# Altium project DCAV32_WINGLET_V1P_OSR.PrjPcb (part 2 of 3)

## Sheet SCH_WINGLET_DISP.SchDoc: Winglet LCD Display
size B; DrawnBy: HCAdam; Organization: Aerospace Village; DocumentNumber: WINGLET; Revision: A; SheetNumber: 5; SheetTotal: 10
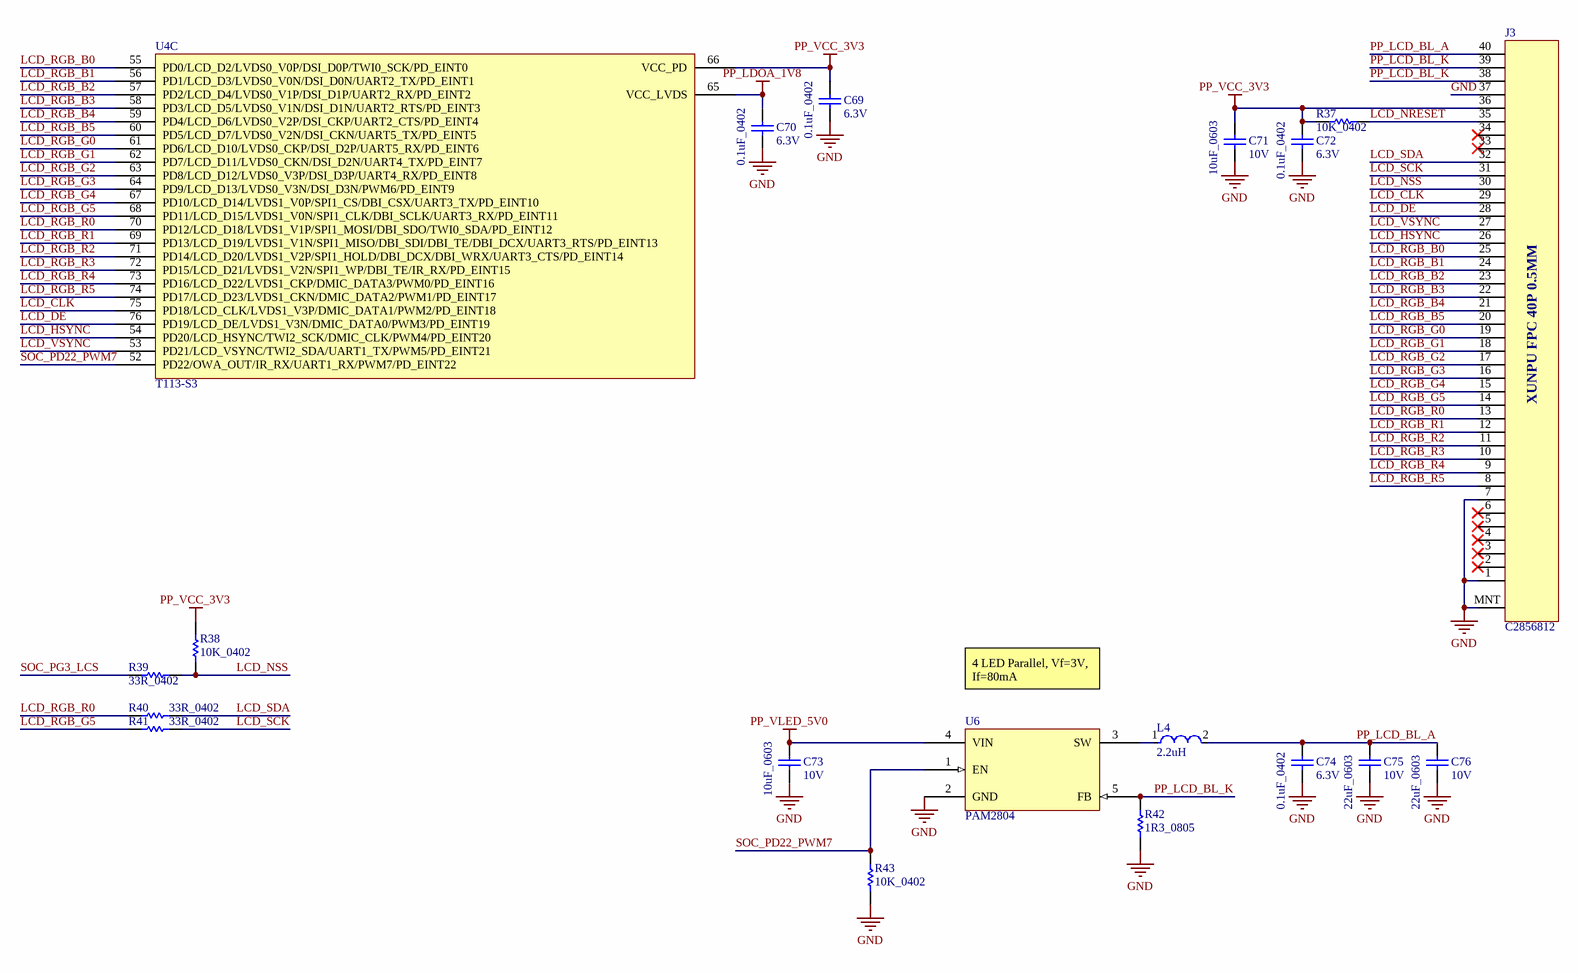
[diagram p4: SCH_WINGLET_DISP.SchDoc]

### Parts
C69  0.1uF_0402  Voltage Rating: 6.3V  [CAPC1005X56X25NL10T15]
C70  0.1uF_0402  Voltage Rating: 6.3V  [CAPC1005X56X25NL10T15]
C71  10uF_0603  Voltage Rating: 10V  [CAPC1609X100X15NL20]
C72  0.1uF_0402  Voltage Rating: 6.3V  [CAPC1005X56X25NL10T15]
C73  10uF_0603  Voltage Rating: 10V  [CAPC1609X100X15NL20]
C74  0.1uF_0402  Voltage Rating: 6.3V  [CAPC1005X56X25NL10T15]
C75  22uF_0603  Voltage Rating: 10V  [CAPC1608X100X20NL10]
C76  22uF_0603  Voltage Rating: 10V  [CAPC1608X100X20NL10]
J3  C2856812  [LCSC_FPC_40P_0P5MM]
L4  2.2uH  [FP-NR3015-MFG]
R37  10K_0402  [RESC1005X40X25NL05T05]
R38  10K_0402  [RESC1005X40X25NL05T05]
R39  33R_0402  [RESC1005X40X25NL05T05]
R40  33R_0402  [RESC1005X40X25NL05T05]
R41  33R_0402  [RESC1005X40X25NL05T05]
R42  1R3_0805  [RESC2013X50X30NL20T20]
R43  10K_0402  [RESC1005X40X25NL05T05]
U4  T113-S3  [TSQFP40P1600X1600X160_HS-129N]  (part C of 7)
U6  PAM2804  [SOT95P292X115-5N]

### Nets
GND: C69.1 C70.1 C71.1 C72.1 C73.1 C74.1 C75.1 C76.1 J3.1 J3.7 J3.37 J3.MNT R42.1 R43.2 U6.2(GND)
PP_LDOA_1V8: C70.2 U4.65(VCC_LVDS)
PP_VCC_3V3: C69.2 C71.2 C72.2 J3.36 R37.1 R38.1 U4.66(VCC_PD)
PP_VLED_5V0: C73.2 U6.4(VIN)
LCD_CLK: J3.29 U4.75(PD18/LCD_CLK/LVDS1_V3P/DMIC_DATA1/PWM2/PD_EINT18)
LCD_DE: J3.28 U4.76(PD19/LCD_DE/LVDS1_V3N/DMIC_DATA0/PWM3/PD_EINT19)
LCD_HSYNC: J3.26 U4.54(PD20/LCD_HSYNC/TWI2_SCK/DMIC_CLK/PWM4/PD_EINT20)
LCD_NRESET: J3.35 R37.2
LCD_NSS: J3.30 R38.2 R39.2
LCD_RGB_B0: J3.25 U4.55(PD0/LCD_D2/LVDS0_V0P/DSI_D0P/TWI0_SCK/PD_EINT0)
LCD_RGB_B1: J3.24 U4.56(PD1/LCD_D3/LVDS0_V0N/DSI_D0N/UART2_TX/PD_EINT1)
LCD_RGB_B2: J3.23 U4.57(PD2/LCD_D4/LVDS0_V1P/DSI_D1P/UART2_RX/PD_EINT2)
LCD_RGB_B3: J3.22 U4.58(PD3/LCD_D5/LVDS0_V1N/DSI_D1N/UART2_RTS/PD_EINT3)
LCD_RGB_B4: J3.21 U4.59(PD4/LCD_D6/LVDS0_V2P/DSI_CKP/UART2_CTS/PD_EINT4)
LCD_RGB_B5: J3.20 U4.60(PD5/LCD_D7/LVDS0_V2N/DSI_CKN/UART5_TX/PD_EINT5)
LCD_RGB_G0: J3.19 U4.61(PD6/LCD_D10/LVDS0_CKP/DSI_D2P/UART5_RX/PD_EINT6)
LCD_RGB_G1: J3.18 U4.62(PD7/LCD_D11/LVDS0_CKN/DSI_D2N/UART4_TX/PD_EINT7)
LCD_RGB_G2: J3.17 U4.63(PD8/LCD_D12/LVDS0_V3P/DSI_D3P/UART4_RX/PD_EINT8)
LCD_RGB_G3: J3.16 U4.64(PD9/LCD_D13/LVDS0_V3N/DSI_D3N/PWM6/PD_EINT9)
LCD_RGB_G4: J3.15 U4.67(PD10/LCD_D14/LVDS1_V0P/SPI1_CS/DBI_CSX/UART3_TX/PD_EINT10)
LCD_RGB_G5: J3.14 R41.1 U4.68(PD11/LCD_D15/LVDS1_V0N/SPI1_CLK/DBI_SCLK/UART3_RX/PD_EINT11)
LCD_RGB_R0: J3.13 R40.1 U4.70(PD12/LCD_D18/LVDS1_V1P/SPI1_MOSI/DBI_SDO/TWI0_SDA/PD_EINT12)
LCD_RGB_R1: J3.12 U4.69(PD13/LCD_D19/LVDS1_V1N/SPI1_MISO/DBI_SDI/DBI_TE/DBI_DCX/UART3_RTS/PD_EINT13)
LCD_RGB_R2: J3.11 U4.71(PD14/LCD_D20/LVDS1_V2P/SPI1_HOLD/DBI_DCX/DBI_WRX/UART3_CTS/PD_EINT14)
LCD_RGB_R3: J3.10 U4.72(PD15/LCD_D21/LVDS1_V2N/SPI1_WP/DBI_TE/IR_RX/PD_EINT15)
LCD_RGB_R4: J3.9 U4.73(PD16/LCD_D22/LVDS1_CKP/DMIC_DATA3/PWM0/PD_EINT16)
LCD_RGB_R5: J3.8 U4.74(PD17/LCD_D23/LVDS1_CKN/DMIC_DATA2/PWM1/PD_EINT17)
LCD_SCK: J3.31 R41.2
LCD_SDA: J3.32 R40.2
LCD_VSYNC: J3.27 U4.53(PD21/LCD_VSYNC/TWI2_SDA/UART1_TX/PWM5/PD_EINT21)
PP_LCD_BL_A: C74.2 C75.2 C76.2 J3.40 L4.2
PP_LCD_BL_K: J3.38 J3.39 R42.2 U6.5(FB)
SOC_PD22_PWM7: R43.1 U4.52(PD22/OWA_OUT/IR_RX/UART1_RX/PWM7/PD_EINT22) U6.1(EN)
SOC_PG3_LCS: R39.1
NetL4_1: L4.1 U6.3(SW)

Not connected (* = marked no-connect by the designer): J3 2* 3* 4* 5* 6* 33* 34*

### Notes on the sheet
- 4 LED Parallel, Vf=3V, If=80mA
- Title
- Size:
- Date:
- B
- Project:
- Revision:
- Sheet
- of
- Drawn By:
- (in symbol FPC-05F-40PH20) XUNPU FPC 40P 0.5MM

### Library data of the parts
C69 C70 C72 C74 = CMP-2008-02743-1: as C7 on sheet SCH_WINGLET_BMU; Part Number: 04026D104KAT2A
C71 C73 = CMP-2006-00191-1: Part Number: TACL106M006XTA; Manufacturer: AVX Interconnect / Elco
C75 C76 = CMP-2000-05441-1: Chip Capacitor, 22 uF, +/- 20%, 10 V, -55 to 85 degC, 0603 (1608 Metric), RoHS, Tape and Reel / PN: C1608X5R1A226M080AC; Manufacturer: TDK; PCN Part Number: MLCCPartNumberChange30/Nov/2012; Product Training Modules: CSeriesGeneralApplicationsSEAT,CCV,andTVCLDesignToolsGuidetoReplacinganElectrolyticCapacitorwithanMLCC; Other Names: 445-9077-1; Design Resources: 20WNon-IsolatedBuckLEDDriverUsingPLLNK460KG; Online Catalog: CSeries,GeneralPurpose; Capacitance: 22µF; Temperature Coefficient: X5R; Kits: 445-9014-KIT-ND-KITMLCC100PF-22UF060310-50V; Packaging: CutTape(CT); Standard Package: 1; Package / Case: 0603(1608Metric); Lead Style: -; Features: -; Ratings: -; Voltage - Rated: 10V; Operating Temperature: -55degC~85degC; Applications: GeneralPurpose; Package Reference: 603; Datasheet URL: http://download.siliconexpert.com/pdfs/2015/4/21/15/54/45/779/tdk_/manual/37024850441143360mlcc_commercial_general_en.pdf; Datasheet Version: Mar-15; Mounting Type: SurfaceMount,MLCC; Lead Spacing: -; Size / Dimension: 0.063"Lx0.031"W(1.60mmx0.80mm); Height - Seated (Max): -; Package Description: 2-Pin Surface Mount Device, Body 1.6 x 0.8 mm; Manufacturer URL: http://www.tdk.com/; RoHS Information: RoHSCertificate-MLCC; Tolerance: ±20%; Series: C; Thickness (Max): 0.035"(0.90mm); Family: CeramicCapacitors; Category: Capacitors
J3 = FPC-05F-40PH20: XUNPU FPC 40P 0.5MM / C2856812
L4 = CMP-0569-00001-3: SMD Power Inductors 2.2uH ±20% 1.48A 72mΩ / NR3015T2R2M; RMS Current (Irms): 1.5A; Shielding: Shielded; Self Resonant Frequency: 64MHz; Test Frequency: 100kHz; DC Resistance (DCR): 72mR; Core Material: Ferrite; Package Quantity: 1; Current Rating: 1.48A; Height - Seated (Max): 0.059inch; Width: 0.118inch; Inductance Tolerance: 20%; Tolerance: 20%; Resistor Type: Wirewound; RoHS Compliant: Yes; Case/Package: 3015; Length: 0.118inch; Max DC Current: 1.5A; Max Operating Temperature: 120°C; Inductance: 2.2uH; Saturation Current: 1.48A; Min Operating Temperature: -25°C; Height: 1.5mm; Series: NR; Lead Free: Lead Free; Packaging: Tape and Reel; Halogen Free: Halogen Free; Termination: SMD/SMT; Number of Pins: 2
R37 R38 R43 = CMP-2000-07588-1: Chip Resistor, 10 KOhm, +/- 1%, 0.1 W, -55 to 155 degC, 0402 (1005 Metric), RoHS, Tape and Reel / ERJ2RKF1002X; Manufacturer: Panasonic; Power Rating: 100mW; Voltage Rating: 50V; Resistance: 10KOhm; Case\/Package: 0402; Temperature Coefficient: 100ppm\/degreesC; RoHSCompliant: True; Lead Free: LeadFree; Package Quantity: 1; Contact Plating: Tin; Length: 1mm; Radiation Hardening: No; REACH SVHC: NoSVHC; Max Operating Temperature: 155degC; Depth: 0.5mm; Case Code (Imperial): 0402; Military Standard: Not; Package Description: 2-Pin Surface Mount Device, Body 1 x 0.5 mm; Termination: SMD/SMT; Case Code (Metric): 1005; Height: 0.35mm; Packaging: TapeandReel; Voltage Rating (DC): 50V; Package Reference: 402; Number of Pins: 2; Tolerance: 1%; Mounting Technology: SurfaceMount; Width: 0.02inch; Mount: SurfaceMount; Datasheet URL: https://industrial.panasonic.com/cdbs/www-data/pdf/RDA0000/AOA0000C304.pdf; Composition: ThickFilm; Datasheet Version: 02/2017; Manufacturer URL: http://www.panasonic.com/; Max Power Dissipation: 100mW; Number of Terminations: 2; Min Operating Temperature: -55degC
R39-R41 = CMP-2002-01146-1: ERJ2RKF33R0X; Manufacturer: Panasonic; Part Number: ERJ2RKF33R0X
R42 = CMP-2001-03654-1: CRCW08051R30JNEA; Manufacturer: Vishay Dale; Part Number: CRCW08051R30JNEA
U4 = T113-S3: Allwinner Dual-core ARM Cortex-A7 Smart Control and Display SoC
U6 = PAM2804: 1A 1.5MHz STEP-DOWN CONSTANT CURRENT, HIGH EFFICIENCY LED DRIVER

## Sheet SCH_WINGLET_WIFI.SchDoc: Winglet Wi-Fi
size B; DrawnBy: HCAdam; Organization: Aerospace Village; DocumentNumber: WINGLET; Revision: A; SheetNumber: 6; SheetTotal: 10
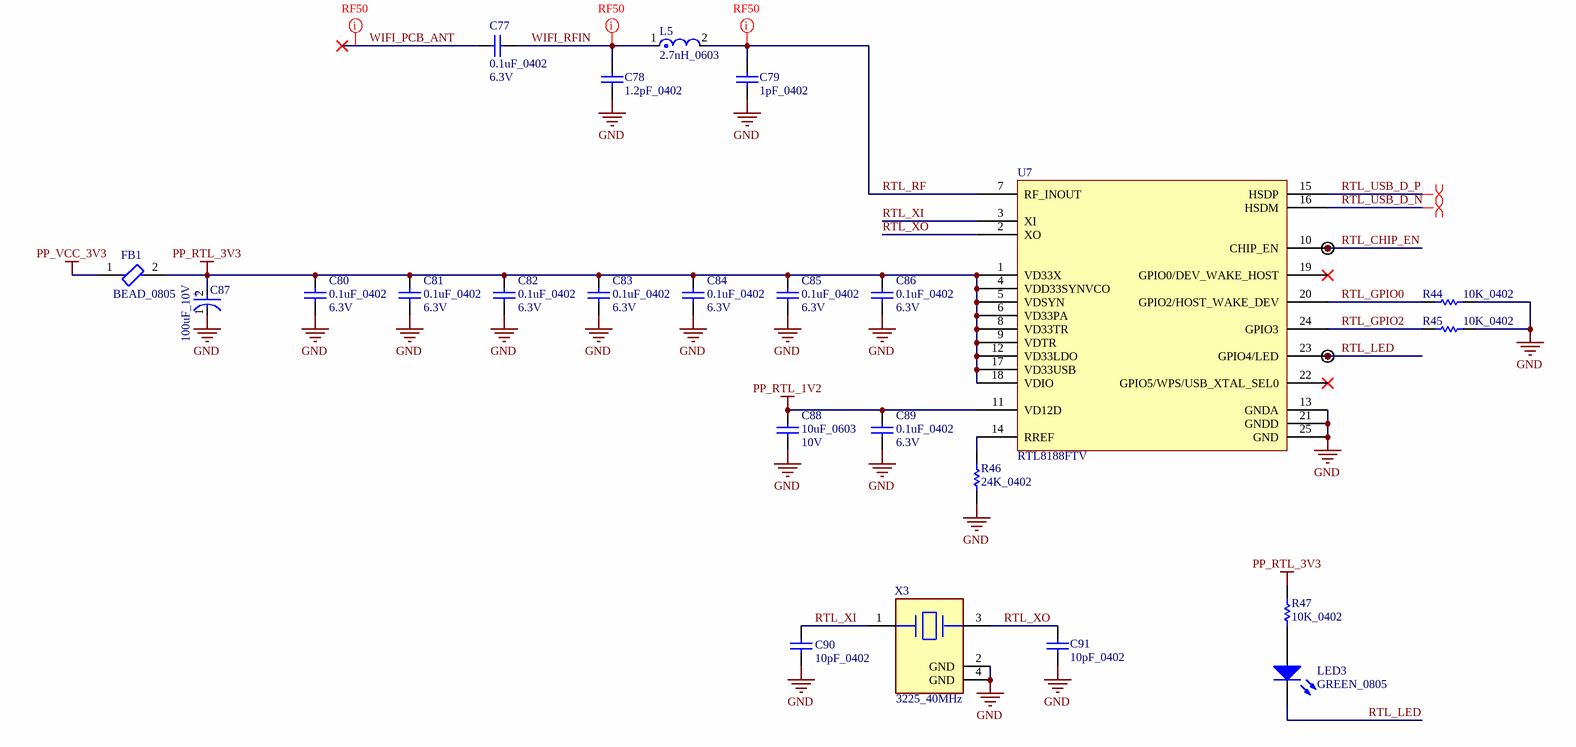
[diagram p5: SCH_WINGLET_WIFI.SchDoc]

### Parts
C77  0.1uF_0402  Voltage Rating: 6.3V  [CAPC1005X56X25NL10T15]
C78  1.2pF_0402  [CAPC1005X61X26NL10T16]
C79  1pF_0402  [CAPC1005X56X25NL10T15]
C80  0.1uF_0402  Voltage Rating: 6.3V  [CAPC1005X56X25NL10T15]
C81  0.1uF_0402  Voltage Rating: 6.3V  [CAPC1005X56X25NL10T15]
C82  0.1uF_0402  Voltage Rating: 6.3V  [CAPC1005X56X25NL10T15]
C83  0.1uF_0402  Voltage Rating: 6.3V  [CAPC1005X56X25NL10T15]
C84  0.1uF_0402  Voltage Rating: 6.3V  [CAPC1005X56X25NL10T15]
C85  0.1uF_0402  Voltage Rating: 6.3V  [CAPC1005X56X25NL10T15]
C86  0.1uF_0402  Voltage Rating: 6.3V  [CAPC1005X56X25NL10T15]
C87  100uF_10V  [FP-TAJB-MFG]
C88  10uF_0603  Voltage Rating: 10V  [CAPC1609X100X15NL20]
C89  0.1uF_0402  Voltage Rating: 6.3V  [CAPC1005X56X25NL10T15]
C90  10pF_0402  [CAPC1006X50X20NL10T10]
C91  10pF_0402  [CAPC1006X50X20NL10T10]
FB1  BEAD_0805  [FP-BLM21-0_2-t0_85-e0_5-IPC_B]
L5  2.7nH_0603  [FP-LQG18HH_00-IPC_B]
LED3  GREEN_0805  [0805_A]
R44  10K_0402  [RESC1005X40X25NL05T05]
R45  10K_0402  [RESC1005X40X25NL05T05]
R46  24K_0402  [RESC1005X40X25NL05T05]
R47  10K_0402  [RESC1005X40X25NL05T05]
TP25  TESTPOINT  [TESTPOINT-0.7MM-SINGLE-LAYER]  (value not drawn)  (no BOM)
TP26  TESTPOINT  [TESTPOINT-0.7MM-SINGLE-LAYER]  (value not drawn)  (no BOM)
U7  RTL8188FTV  [QFN50P400X400X90_HS-25N_RTL]
X3  3225_40MHz  [FP-ABM8-MFG]

### Nets
GND: C78.1 C79.1 C80.1 C81.1 C82.1 C83.1 C84.1 C85.1 C86.1 C87.1(C) C88.1 C89.1 C90.1 C91.1 R44.1 R45.1 R46.1 U7.13(GNDA) U7.21(GNDD) U7.25(GND) X3.2(GND) X3.4(GND)
PP_RTL_1V2: C88.2 C89.2 U7.11(VD12D)
PP_RTL_3V3: C80.2 C81.2 C82.2 C83.2 C84.2 C85.2 C86.2 C87.2(A) FB1.2 R47.1 U7.1(VD33X) U7.4(VDD33SYNVCO) U7.5(VDSYN) U7.6(VD33PA) U7.8(VD33TR) U7.9(VDTR) U7.12(VD33LDO) U7.17(VD33USB) U7.18(VDIO)
PP_VCC_3V3: FB1.1
RTL_CHIP_EN: TP25.1 U7.10(CHIP_EN)
RTL_GPIO0: R44.2 U7.20(GPIO2/HOST_WAKE_DEV)
RTL_GPIO2: R45.2 U7.24(GPIO3)
RTL_LED: LED3.1(K) TP26.1 U7.23(GPIO4/LED)
RTL_RF: C79.2 L5.2 U7.7(RF_INOUT)
RTL_USB_D_N: U7.16(HSDM)
RTL_USB_D_P: U7.15(HSDP)
RTL_XI: C90.2 U7.3(XI) X3.1
RTL_XO: C91.2 U7.2(XO) X3.3
WIFI_PCB_ANT: C77.2
WIFI_RFIN: C77.1 C78.2 L5.1
NetLED3_2: LED3.2(A) R47.2
NetR46_2: R46.2 U7.14(RREF)

Not connected (* = marked no-connect by the designer): U7 19(GPIO0/DEV_WAKE_HOST)* 22(GPIO5/WPS/USB_XTAL_SEL0)*

### Layout directives
differential pair: RTL_USB_D_N, RTL_USB_D_P
net class RF_50Z: RTL_RF, WIFI_PCB_ANT, WIFI_RFIN

### Notes on the sheet
- Title
- Size:
- Date:
- B
- Project:
- Revision:
- Sheet
- of
- Drawn By:
- (in symbol CMP-04424-000366-1) +

### Library data of the parts
C77 C80-C86 C89 = CMP-2008-02743-1: as C7 on sheet SCH_WINGLET_BMU; Part Number: 04026D104KAT2A
C78 = CMP-2008-01995-1: VJ0402D1R0BXCAJ; Manufacturer: Vitramon; Part Number: VJ0402D1R0BXCAJ
C79 = CMP-1034-00084-2: 04025A1R2BAT2A; Manufacturer: AVX Interconnect / Elco; Part Number: 04025A1R2BAT2A
C87 = CMP-04424-000366-1: 100uF 10V ±10% 1.7Ω SMD CASE-B (3528) Tantalum Capacitor; Voltage Rating (DC): 6.3V; ESR (Equivalent Series Resistance): 1.7R; Polarity: Polar; Leakage Current: 6.3uA; Height: 1.9mm; Depth: 2.8mm; Length: 3.5mm; Min Operating Temperature: -55°C; Width: 2.8mm; Series: TAJ; Lead Free: Lead Free; Case/Package: 1210; Voltage: 6.3V; Mount: Surface Mount; Tolerance: 10%; Capacitance: 100uF; Radiation Hardening: No; REACH SVHC: No SVHC; Voltage Rating: 6.3V; Case Code (Metric): 3528; Dissipation Factor: 10%; Packaging: Tape and Reel; Construction: Flat; Features: General Purpose; Max Operating Temperature: 125°C; RoHS Compliant: Yes; Package Quantity: 1; Dielectric Material: Tantalum; Termination: SMD/SMT; Case Code (Imperial): 1210; Height - Seated (Max): 0.083inch
C88 = CMP-2006-00191-1: as C71 on sheet SCH_WINGLET_DISP
C90 C91 = CMP-2008-04829-1: 0402YJ100FBSTR; Manufacturer: AVX Interconnect / Elco; Part Number: 0402YJ100FBSTR
FB1 = CMP-0686-00717-3: Chip Ferrite Bead, 0805, 150Ω @ 100MHz, 0.09Ω, 25%, 1A; Number of Circuits: 1; Max Current Rating: 800mA; DC Resistance (DCR): 100mR; Shielding: Unshielded; DC Current: 200mA; Impedance: 150R; Contact Plating: Tin; Weight: 0.000194oz; Series: EMIFIL®, BLM21A; Core Material: Ferrite; Test Frequency: 100MHz; Case Code (Metric): 2012; Package Quantity: 4000; Lead Free: Lead Free; Max Operating Temperature: 125°C; Case Code (Imperial): 0805; Material: Ferrite; Min Operating Temperature: -55°C; Tolerance: 25%; Length: 2mm; DC Resistance-Max: 100mR; Width: 1.25mm; RoHS Compliant: Yes; Packaging: Tape and Reel; REACH SVHC: No SVHC; Depth: 1.45mm; Number of Pins: 2; Radiation Hardening: No; Current Rating: 800mA; Height: 0.85mm; Termination: SMD/SMT; Number of Lines: 1; Max DC Current: 200mA; Case/Package: 0805
L5 = CMP-06042-013926-1: Multilayer type RF Inductor 2.7nH ±0.3nH 0.12Ω 1000mA 0603 / LQG18HN2N7S00D; Current Rating: 500mA; DC Resistance (DCR): 150mR; Q Factor: 12; Self Resonant Frequency: 6GHz; Test Frequency: 100MHz; Shielding: Unshielded; Core Material: Air; Mount: Surface Mount; Lead Free: Lead Free; Length: 1.75mm; Inductance: 2.7nH; Case Code (Imperial): 0603; Military Standard: Not; Case Code (Metric): 1608; Max DC Current: 500mA; Min Operating Temperature: -55°C; Depth: 0.95mm; REACH SVHC: No SVHC; Termination: SMD/SMT; Package Quantity: 4000; Number of Pins: 2; Max Operating Temperature: 85°C; Height: 0.8mm; Case/Package: 0603; Width: 0.8mm; Packaging: Tape and Reel; Height - Seated (Max): 0.037inch; DC Current: 500mA; Radiation Hardening: No
LED3 = CMP-1426-00007-1: SMD mono-color Chip LED, WL-SMCW, Green / 150080GS75000; Manufacturer: Wuerth Elektronik; PackageReference: 0805_A; Color: Green; PartNumber: 150080GS75000; ComponentLink2URL: http://katalog.we-online.com/led/datasheet/150080GS75000.pdf; ComponentLink1URL: http://www.we-online.com; ComponentLink1Description: Manufacturer URL; ComponentLink2Description: Datasheet
R44 R45 R47 = CMP-2000-07588-1: as R37 on sheet SCH_WINGLET_DISP; RoHSCompliant: True; Lead Free: LeadFree; Package Quantity: 1; Contact Plating: Tin; Length: 1mm; Radiation Hardening: No; REACH SVHC: NoSVHC; Max Operating Temperature: 155degC; Depth: 0.5mm; Case Code (Imperial): 0402; Military Standard: Not; Package Description: 2-Pin Surface Mount Device, Body 1 x 0.5 mm; Termination: SMD/SMT; Case Code (Metric): 1005; Height: 0.35mm; Packaging: TapeandReel; Voltage Rating (DC): 50V; Package Reference: 402; Number of Pins: 2; Tolerance: 1%; Mounting Technology: SurfaceMount; Width: 0.02inch; Mount: SurfaceMount; Datasheet URL: https://industrial.panasonic.com/cdbs/www-data/pdf/RDA0000/AOA0000C304.pdf; Composition: ThickFilm; Datasheet Version: 02/2017; Manufacturer URL: http://www.panasonic.com/; Max Power Dissipation: 100mW; Number of Terminations: 2; Min Operating Temperature: -55degC
R46 = CMP-2000-07588-1: Manufacturer: Panasonic; Power Rating: 100mW; Voltage Rating: 50V; Resistance: 24KOhm; Tolerance: 1%; Case\/Package: 0402; Temperature Coefficient: 100ppm\/degreesC; RoHSCompliant: True; Lead Free: LeadFree; Package Quantity: 1; Contact Plating: Tin; Length: 1mm; Radiation Hardening: No; REACH SVHC: NoSVHC; Max Operating Temperature: 155degC; Depth: 0.5mm; Case Code (Imperial): 0402; Military Standard: Not; Package Description: 2-Pin Surface Mount Device, Body 1 x 0.5 mm; Termination: SMD/SMT; Case Code (Metric): 1005; Height: 0.35mm; Packaging: TapeandReel; Voltage Rating (DC): 50V; Package Reference: 402; Number of Pins: 2; Mounting Technology: SurfaceMount; Width: 0.02inch; Mount: SurfaceMount; Datasheet URL: https://industrial.panasonic.com/cdbs/www-data/pdf/RDA0000/AOA0000C304.pdf; Composition: ThickFilm; Datasheet Version: 02/2017; Manufacturer URL: http://www.panasonic.com/; Max Power Dissipation: 100mW; Number of Terminations: 2; Min Operating Temperature: -55degC
TP25 TP26 = TP_07: TESTPOINT SINGLE LAYER 0.7MM; AEC-Q: Yes; PPAP: Unknown; Selective Soldering: No; Value: Unknown; RoHS: Yes; Package: BOARD_FEATURE; Washable: Yes; Mounting: Unknown
U7 = RTL8188FTV: Single-chip IEEE 812.11b/g/n 1T1R WLAN
X3 = CMP-27762-008947-1: Crystal 40MHz ±10ppm 10pF SMD-4 3.2mm x 2.5mm / ABM8-40.000MHZ-10-1-U-T; ESR (Equivalent Series Resistance): 35R; Frequency: 40MHz; Number of Pins: 4; Frequency Stability: 10ppm; Radiation Hardening: No; Tolerance: 10ppm; Min Operating Temperature: -10°C; Resistor Type: Ceramic; Width: 0.098inch; Max Operating Temperature: 60°C; Case/Package: SMD/SMT; Packaging: Tape and Reel; Mount: Surface Mount; Termination: SMD/SMT; Load Capacitance: 10pF; Series: ABM8; Height: 0.031inch; Frequency Tolerance: 10ppm; Operating Frequency: 40 MHz; Package Quantity: 1000; Length: 0.126inch; Lead Free: Lead Free

## Sheet SCH_WINGLET_GNSS.SchDoc: Winglet GNSS
size B; DrawnBy: HCAdam; Organization: Aerospace Village; DocumentNumber: WINGLET; Revision: A; SheetNumber: 7; SheetTotal: 10
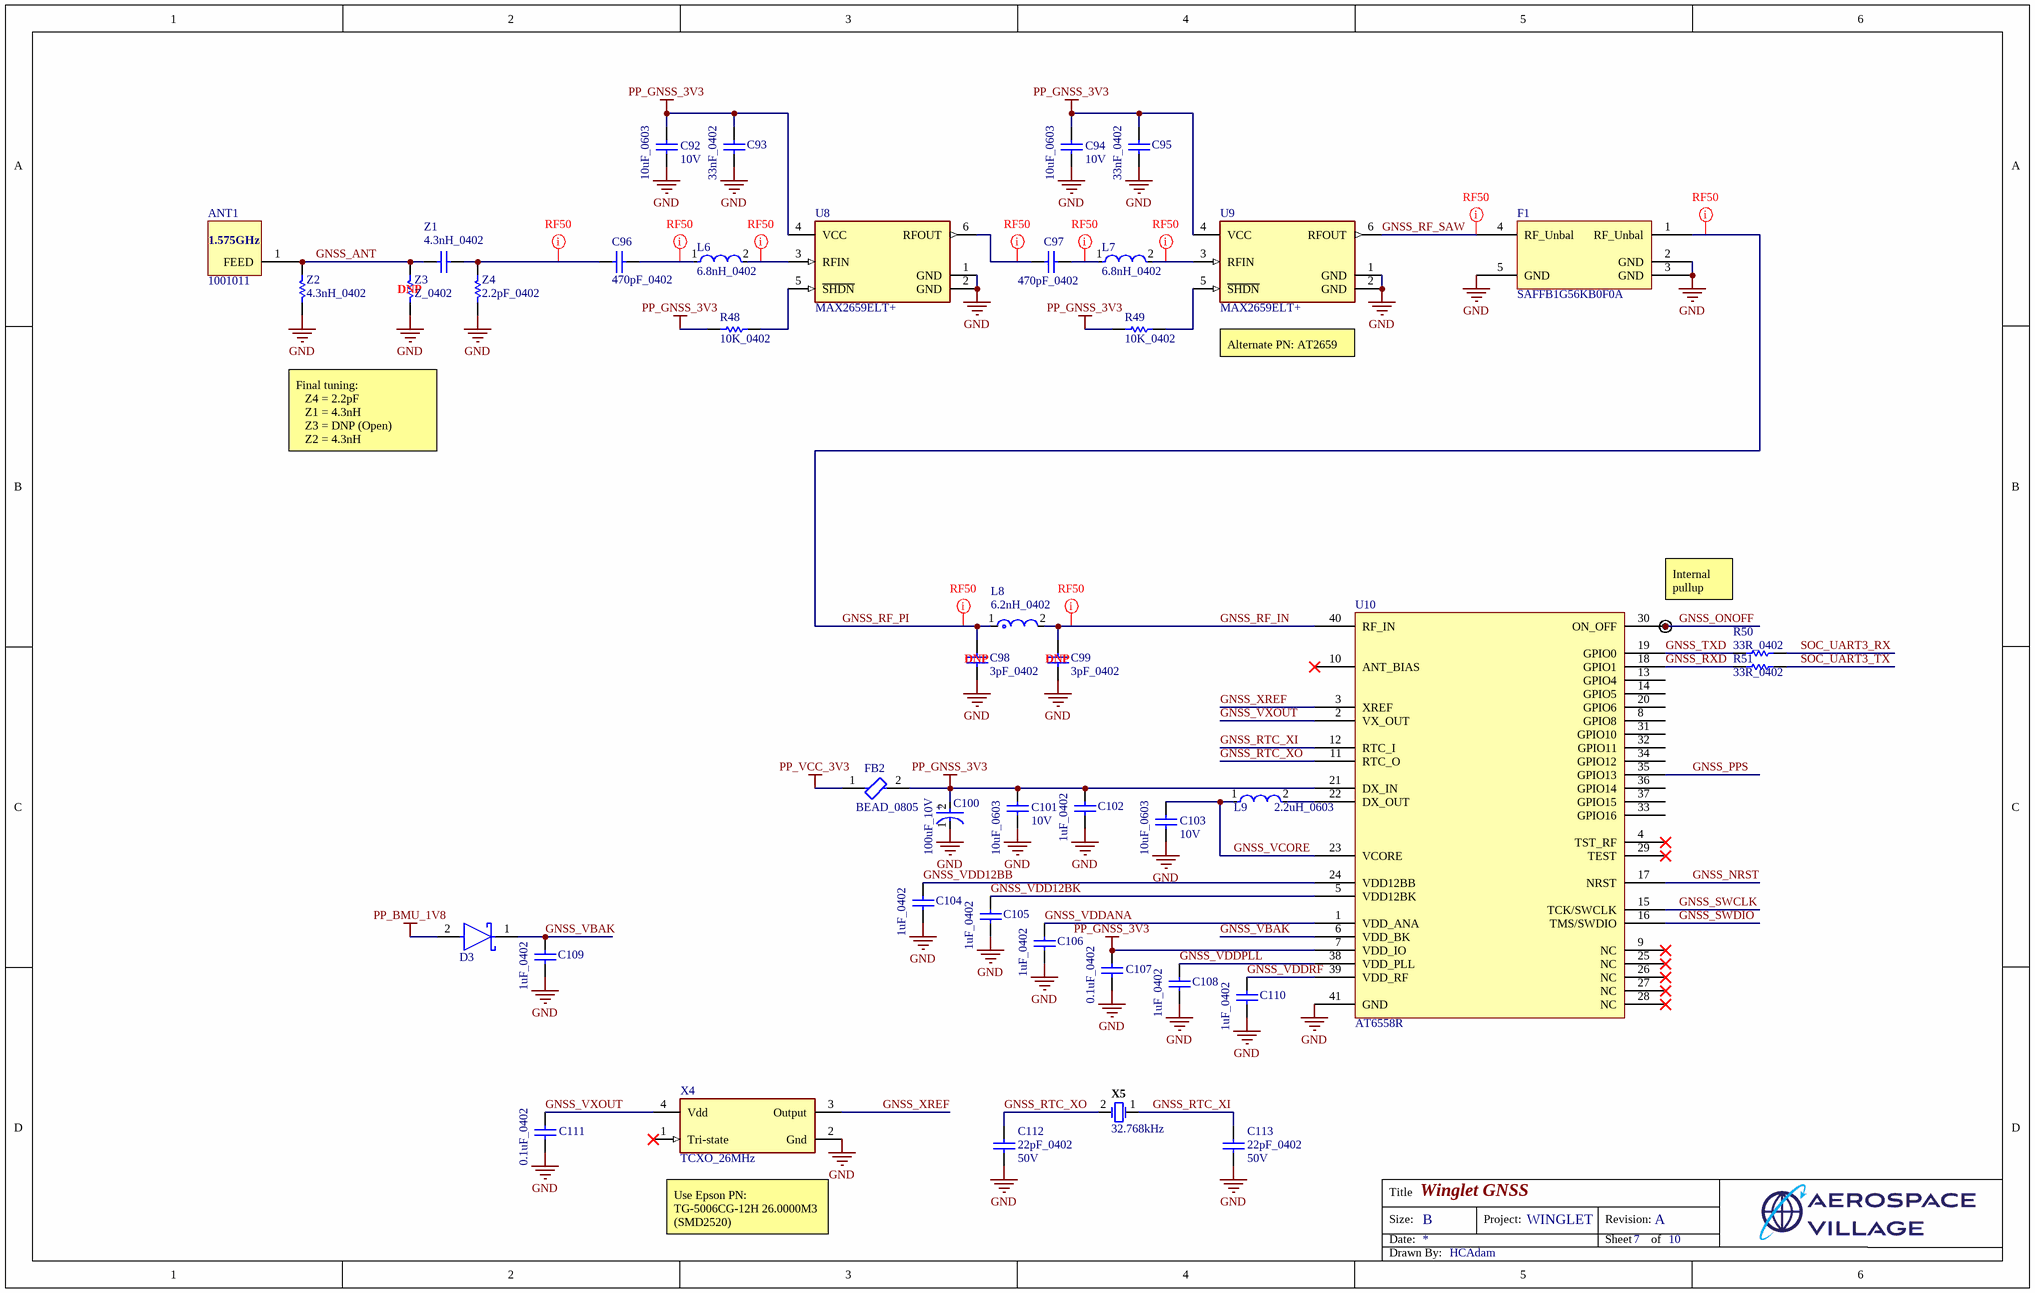
[diagram p6: SCH_WINGLET_GNSS.SchDoc]

### Parts
ANT1  1001011  [ANT1001011]
C92  10uF_0603  Voltage Rating: 10V  [CAPC1609X100X15NL20]
C93  33nF_0402  [CAPC1005X56X25NL10T15]
C94  10uF_0603  Voltage Rating: 10V  [CAPC1609X100X15NL20]
C95  33nF_0402  [CAPC1005X56X25NL10T15]
C96  470pF_0402  [CAPC1005X56X25NL10T15]
C97  470pF_0402  [CAPC1005X56X25NL10T15]
C98  3pF_0402  [CAPC1005X55X25NL05T10]
C99  3pF_0402  [CAPC1005X55X25NL05T10]
C100  100uF_10V  [FP-TAJB-MFG]
C101  10uF_0603  Voltage Rating: 10V  [CAPC1609X100X15NL20]
C102  1uF_0402  [CAPC1005X55X25NL5T10]
C103  10uF_0603  Voltage Rating: 10V  [CAPC1609X100X15NL20]
C104  1uF_0402  [CAPC1005X55X25NL5T10]
C105  1uF_0402  [CAPC1005X55X25NL5T10]
C106  1uF_0402  [CAPC1005X55X25NL5T10]
C107  0.1uF_0402  [CAPC1005X56X25NL10T15]
C108  1uF_0402  [CAPC1005X55X25NL5T10]
C109  1uF_0402  [CAPC1005X55X25NL5T10]
C110  1uF_0402  [CAPC1005X55X25NL5T10]
C111  0.1uF_0402  [CAPC1005X56X25NL10T15]
C112  22pF_0402  Voltage Rating: 50V  [CAPC1005X56X25LL10T15]
C113  22pF_0402  Voltage Rating: 50V  [CAPC1005X56X25LL10T15]
D3  BAT54KFILM  [FP-SOD-523-MFG]  (value not drawn)
F1  SAFFB1G56KB0F0A  [SAW80P110X50-5L]
FB2  BEAD_0805  [FP-BLM21-0_2-t0_85-e0_5-IPC_B]
L6  6.8nH_0402  [FP-LQW15AN_00-W0_6-0_1-MFG]
L7  6.8nH_0402  [FP-LQW15AN_00-W0_6-0_1-MFG]
L8  6.2nH_0402  [FP-LQG15HH_02-IPC_C]
L9  2.2uH_0603  [FP-MLZ1608-IPC_C]
R48  10K_0402  [RESC1005X40X25NL05T05]
R49  10K_0402  [RESC1005X40X25NL05T05]
R50  33R_0402  [RESC1005X40X25NL05T05]
R51  33R_0402  [RESC1005X40X25NL05T05]
TP27  TESTPOINT  [TESTPOINT-0.7MM-SINGLE-LAYER]  (value not drawn)  (no BOM)
U8  MAX2659ELT+  [FP-L611-2-MFG]
U9  MAX2659ELT+  [FP-L611-2-MFG]
U10  AT6558R  [QFN40P500X500X90_HS-41N]
X4  TCXO_26MHz  [FP-ECS-TXO-2520-MFG]
X5  32.768kHz  [ABRA-ABS07_A_V]
Z1  4.3nH_0402  [CAPC1006X50X20NL10T10]
Z2  4.3nH_0402  [RESC1005X40X25NL05T05]
Z3  Z_0402  [RESC1005X40X25NL05T05]
Z4  2.2pF_0402  [RESC1005X40X25NL05T05]

### Nets
GND: C92.1 C93.2 C94.1 C95.2 C98.1 C99.1 C100.1(C) C101.1 C102.1 C103.1 C104.1 C105.1 C106.1 C107.1 C108.1 C109.1 C110.1 C111.1 C112.1 C113.1 F1.2(GND) F1.3(GND) F1.5(GND) U8.1(GND) U8.2(GND) U9.1(GND) U9.2(GND) U10.41(GND) X4.2(Gnd) Z2.1 Z3.1 Z4.1
PP_BMU_1V8: D3.2(A)
PP_GNSS_3V3: C92.2 C93.1 C94.2 C95.1 C100.2(A) C101.2 C102.2 C107.2 FB2.2 R48.1 R49.1 U8.4(VCC) U9.4(VCC) U10.7(VDD_IO) U10.21(DX_IN)
PP_VCC_3V3: FB2.1
GNSS_ANT: ANT1.1(FEED) Z1.2 Z2.2 Z3.2
GNSS_NRST: U10.17(NRST)
GNSS_ONOFF: TP27.1 U10.30(ON_OFF)
GNSS_PPS: U10.35(GPIO13)
GNSS_RF_IN: C99.2 L8.2 U10.40(RF_IN)
GNSS_RF_PI: C98.2 F1.1(RF_Unbal) L8.1
GNSS_RF_SAW: F1.4(RF_Unbal) U9.6(RFOUT)
GNSS_RTC_XI: C113.2 U10.12(RTC_I) X5.1
GNSS_RTC_XO: C112.2 U10.11(RTC_O) X5.2
GNSS_RXD: R51.1 U10.18(GPIO1)
GNSS_SWCLK: U10.15(TCK/SWCLK)
GNSS_SWDIO: U10.16(TMS/SWDIO)
GNSS_TXD: R50.1 U10.19(GPIO0)
GNSS_VBAK: C109.2 D3.1(C) U10.6(VDD_BK)
GNSS_VCORE: C103.2 L9.1 U10.23(VCORE)
GNSS_VDD12BB: C104.2 U10.24(VDD12BB)
GNSS_VDD12BK: C105.2 U10.5(VDD12BK)
GNSS_VDDANA: C106.2 U10.1(VDD_ANA)
GNSS_VDDPLL: C108.2 U10.38(VDD_PLL)
GNSS_VDDRF: C110.2 U10.39(VDD_RF)
GNSS_VXOUT: C111.2 U10.2(VX_OUT) X4.4(Vdd)
GNSS_XREF: U10.3(XREF) X4.3(Output)
SOC_UART3_RX: R50.2
SOC_UART3_TX: R51.2
NetC96_1: C96.1 L6.1
NetC96_2: C96.2 Z1.1 Z4.2
NetC97_1: C97.1 L7.1
NetC97_2: C97.2 U8.6(RFOUT)
NetL6_2: L6.2 U8.3(RFIN)
NetL7_2: L7.2 U9.3(RFIN)
NetL9_2: L9.2 U10.22(DX_OUT)
NetR48_2: R48.2 U8.5(~{SHDN})
NetR49_2: R49.2 U9.5(~{SHDN})

Not connected (* = marked no-connect by the designer): U10 4(TST_RF)* 8(GPIO8) 9(NC)* 10(ANT_BIAS)* 13(GPIO4) 14(GPIO5) 20(GPIO6) 25(NC)* 26(NC)* 27(NC)* 28(NC)* 29(TEST)* 31(GPIO10) 32(GPIO11) 33(GPIO16) 34(GPIO12) 36(GPIO14) 37(GPIO15); X4 1(Tri-state)*

### Layout directives
net class RF_50Z: GNSS_RF_IN, GNSS_RF_PI, GNSS_RF_SAW, NetC96_1, NetC96_2, NetC97_1, NetC97_2, NetL6_2, NetL7_2

### Notes on the sheet
- (near U9) Alternate PN: AT2659
- Final tuning:
  Z4 = 2.2pF
  Z1 = 4.3nH
  Z3 = DNP (Open)
  Z2 = 4.3nH
- (near TP27) Internal pullup
- (near X4) Use Epson PN: TG-5006CG-12H 26.0000M3 (SMD2520)
- Title
- Size:
- Date:
- B
- Project:
- Revision:
- Sheet
- of
- Drawn By:
- (in symbol 1001011) 1.575GHz
- (in symbol CMP-04424-000366-1) +

### Library data of the parts
ANT1 = 1001011: GPS/GLONASS/Beidou/Galileo (On/Off Ground) or ISM FR4 Antenna / 1.561, 1.575, 1.603 GHz or 868-928 MHz
C92 C94 C101 C103 = CMP-2006-00191-1: as C71 on sheet SCH_WINGLET_DISP
C93 C95-C97 = CMP-2008-02743-1
C98 C99 = CMP-1034-00238-2: GRM1555C1H3R0BA01D; Manufacturer: Murata; Part Number: GRM1555C1H3R0BA01D; DNP: DNP
C100 = CMP-04424-000366-1: as C87 on sheet SCH_WINGLET_WIFI; Height: 1.9mm; Depth: 2.8mm; Length: 3.5mm; Min Operating Temperature: -55°C; Width: 2.8mm; Series: TAJ; Lead Free: Lead Free; Case/Package: 1210; Voltage: 6.3V; Mount: Surface Mount; Tolerance: 10%; Capacitance: 100uF; Radiation Hardening: No; REACH SVHC: No SVHC; Voltage Rating: 6.3V; Case Code (Metric): 3528; Dissipation Factor: 10%; Packaging: Tape and Reel; Construction: Flat; Features: General Purpose; Max Operating Temperature: 125°C; RoHS Compliant: Yes; Package Quantity: 1; Dielectric Material: Tantalum; Termination: SMD/SMT; Case Code (Imperial): 1210; Height - Seated (Max): 0.083inch
C102 C104-C106 C108-C110 = CMP-1662-00020-1: Chip Capacitor, 1 uF, +/- 10%, 6.3 V, -55 to 85 degC, 0402 (1005 Metric), RoHS, Tape and Reel / GRM155R60J105KE19D; Voltage Rating (DC): 3 V; Type (Capacitors): X5R; Voltage Rating: 6.3 V; Capacitance: 1 uF; ComponentLink2Description: Datasheet; ComponentLink2URL: http://psearch.en.murata.com/capacitor/product/GRM155R60J105KE19%23.pdf; Max Operating Temperature: 85 degC; Min Operating Temperature: -55 degC; Package Quantity: 10000; Mounting Technology: Surface Mount; ComponentLink1Description: Manufacturer URL; ComponentLink1URL: http://www.murata.com/; PackageDescription: 2-Pin Surface Mount Device, Body 1 x 0.5 mm; Tolerance: 10%; Case/Package: 0402; Mount: Surface Mount; Packaging: Tape and Reel; Case Code (Metric): 1005; Radiation Hardening: No; Width: 0.5 mm; Length: 1 mm; DatasheetVersion: 08/2016; Height: 0.5 mm; PartNumber: GRM155R60J105KE19D; RoHSCompliant: true; Case Code (Imperial): 0402; REACH SVHC: No SVHC; Pins: 2
C107 C111 = CMP-2008-02743-1: 04026D104KAT2A; Manufacturer: AVX Interconnect / Elco; Voltage Rating: 6.3V; Part Number: 04026D104KAT2A
C112 C113 = CMP-2008-02613-1: 04025A220JAT2A; Manufacturer: AVX Interconnect / Elco; Part Number: 04025A220JAT2A
D3 = CMP-12187-000026-1: DIODE SCHOTTKY 40V 300MA SOD523; Manufacturer: STMicroelectronics; Capacitance: 7pF; Value: 7pF; Max Surge Forward Current: 1.25A; Peak Reverse Current: 1uA; Max Junction Temp: +150°C; Device Class L2: Diodes; Temperature Range Low: -40°C; Category: Diode; Manufacturer Part Number: BAT54KFILM; Digikey Description: DIODE SCHOTTKY 40V 300MA SOD523; Device Class L3: Schottky Diodes; Automotive: No; Height: 0.7mm; Octopart: https://octopart.com/bat54kfilm-stmicroelectronics-39618022; ComponentLink2Description: Datasheet; Temperature Range High: +150°C; Device Class L1: Discrete Semiconductors; Max Repetitive Reverse Voltage: 40V; RoHS: TRUE; Temperature: -40°C to +150°C; ComponentLink2URL: https://www.st.com/content/ccc/resource/technical/document/datasheet/07/50/54/f2/0d/ba/4a/79/CD00001322.pdf/files/CD00001322.pdf/jcr:content/translations/en.CD00001322.pdf; Lead Free: Yes; Forward Current: 300mA; Package: SOD-523; Mouser Description: Schottky Diodes & Rectifiers schottky diode
F1 = SAFFB1G56KB0F0A: SAW FILTER FOR GPS/GLONASS/BEIDOU2 / 1561.10/1575.42/1602 MHz
FB2 = CMP-0686-00717-3: as FB1 on sheet SCH_WINGLET_WIFI; Contact Plating: Tin; Weight: 0.000194oz; Series: EMIFIL®, BLM21A; Core Material: Ferrite; Test Frequency: 100MHz; Case Code (Metric): 2012; Package Quantity: 4000; Lead Free: Lead Free; Max Operating Temperature: 125°C; Case Code (Imperial): 0805; Material: Ferrite; Min Operating Temperature: -55°C; Tolerance: 25%; Length: 2mm; DC Resistance-Max: 100mR; Width: 1.25mm; RoHS Compliant: Yes; Packaging: Tape and Reel; REACH SVHC: No SVHC; Depth: 1.45mm; Number of Pins: 2; Radiation Hardening: No; Current Rating: 800mA; Height: 0.85mm; Termination: SMD/SMT; Number of Lines: 1; Max DC Current: 200mA; Case/Package: 0805
L6 L7 = CMP-06042-011849-1: Wire Wound RF Inductor 6.8nH ±3% 700mA 0.09Ω 0402 (1005) / LQW15AN6N8H00D; Self Resonant Frequency: 6GHz; Current: 540mA; Shielding: Unshielded; Q Factor: 25; DC Resistance (DCR): 90mR; Test Frequency: 100MHz; Core Material: Air; Min Operating Temperature: -55°C; Case Code (Imperial): 0402; Radiation Hardening: No; Depth: 0.7mm; Height - Seated (Max): 0.024inch; Weight: 2.8E-05oz; Package Quantity: 10000; Width: 0.02inch; Length: 1mm; Max Operating Temperature: 125°C; Max DC Current: 700mA; Military Standard: Not; Resistor Type: Wirewound; Packaging: Tape and Reel; Termination: SMD/SMT; Case/Package: 0402; Height: 0.5mm; Case Code (Metric): 1005; DC Current: 700mA; Mount: Surface Mount; Current Rating: 700mA; Tolerance: 3%; Inductance: 6.8nH
L8 = CMP-06042-000330-1: Multilayer type RF Inductor 6.2nH ±0.3nH 0.19Ω 600mA 0402 / LQG15HN6N2S02D; DC Resistance (DCR): 270mR; Self Resonant Frequency: 4.3GHz; Core Material: Air; Current Rating: 300mA; Q Factor: 8; Shielding: Unshielded; Test Frequency: 100MHz; Width: 0.02inch; Height - Seated (Max): 0.022inch; Lead Free: Lead Free; Military Standard: Not; Height: 0.02inch; Packaging: Tape and Reel; Depth: 0.55mm; Case/Package: 0402; Length: 0.039inch; Inductance: 6.2nH; Max DC Current: 300mA; REACH SVHC: No SVHC; Mount: Surface Mount; Number of Pins: 2; Min Operating Temperature: -55°C; Case Code (Metric): 1005; DC Current: 300mA; Package Quantity: 1; Max Operating Temperature: 125°C; Case Code (Imperial): 0402; Radiation Hardening: No; Termination: SMD/SMT
L9 = CMP-08253-000367-1: Shielded Multilayer Inductor 2.2uH ±20% 500mA 234mΩ SMD 0603 / MLZ1608N2R2LT000; Test Frequency: 2MHz; Core Material: Ferrite; DC Resistance (DCR): 234mR; Saturation Current: 110mA; Self Resonant Frequency: 120MHz; Case Code (Metric): 1608; Mount: Surface Mount; Length: 0.063inch; Shielding: Shielded; Inductance: 2.2uH; Width: 0.031inch; Case Code (Imperial): 0603; Height - Seated (Max): 0.037inch; Package Quantity: 4000; Packaging: Tape and Reel; Min Operating Temperature: -55°C; Current Rating: 500mA; Lead Free: Lead Free; RoHS Compliant: Yes; Max Operating Temperature: 125°C; Tolerance: 20%; Case/Package: 0603
R48 R49 Z2-Z4 = CMP-2000-07588-1: as R37 on sheet SCH_WINGLET_DISP; RoHSCompliant: True; Lead Free: LeadFree; Package Quantity: 1; Contact Plating: Tin; Length: 1mm; Radiation Hardening: No; REACH SVHC: NoSVHC; Max Operating Temperature: 155degC; Depth: 0.5mm; Case Code (Imperial): 0402; Military Standard: Not; Package Description: 2-Pin Surface Mount Device, Body 1 x 0.5 mm; Termination: SMD/SMT; Case Code (Metric): 1005; Height: 0.35mm; Packaging: TapeandReel; Voltage Rating (DC): 50V; Package Reference: 402; Number of Pins: 2; Tolerance: 1%; Mounting Technology: SurfaceMount; Width: 0.02inch; Mount: SurfaceMount; Datasheet URL: https://industrial.panasonic.com/cdbs/www-data/pdf/RDA0000/AOA0000C304.pdf; Composition: ThickFilm; Datasheet Version: 02/2017; Manufacturer URL: http://www.panasonic.com/; Max Power Dissipation: 100mW; Number of Terminations: 2; Min Operating Temperature: -55degC
  Z3: DNP: DNP
R50 R51 = CMP-2002-01146-1: ERJ2RKF33R0X; Manufacturer: Panasonic; Part Number: ERJ2RKF33R0X
TP27 = TP_07: as TP25 on sheet SCH_WINGLET_WIFI; RoHS: Yes; Package: BOARD_FEATURE; Washable: Yes; Mounting: Unknown
U8 U9 = CMP-05725-000003-1: GPS Amp Single Low Noise 1.75GHz 3.6V 6-Pin UDFN; Number of Pins: 6; Contact Plating: Gold
U10 = AT6558R: GNSS/BDS Satellite Positioning SOC
X4 = CMP-40224-000034-1: XTAL OSC TCXO 25.0000MHZ HCMOS / !!! SUBSTITUTE !!!; RoHS Compliant: Yes
X5 = CMP-2000-07587-1: Tuning Fork Crystal, 32.768 KHz, +/- 20 ppm, -40 to 85 degC, 2-Pin SMD, RoHS, Tape and Reel, PN ABS07-120-32.768KHZ-T; Manufacturer: Abracon; Case\/Package: SMD/SMT; Series Resistance: 60KOhm; Frequency Tolerance: 20ppm; Load Capacitance: 6pF; ESR (Equivalent Series Resistance): 55KOhm; Max Operating Temperature: 85degC; Width: 0.061inch; Radiation Hardening: No; Lead Free: LeadFree; RoHSCompliant: True; Depth: 1.5mm; Datasheet URL: http://www.abracon.com/Resonators/ABS07-120-32.768kHz-T.pdf; Frequency: 32.768KHz; Termination: SMD/SMT; Manufacturer URL: http://www.abracon.com/; Package Quantity: 3000; Packaging: TapeandReel; Number of Pins: 2; Height: 0.035inch; Package Description: 2-Pin Surface Mount Device, Body 3.2 x 1.5 mm; Package Reference: ABS07; Mount: SurfaceMount; Tolerance: 20ppm; Mounting Technology: SurfaceMount; REACH SVHC: NoSVHC; Datasheet Version: 11/2014; Length: 3.2mm; Min Operating Temperature: -40degC
Z1 = CMP-2008-04764-1: 04023J1R6ABSTR; Manufacturer: AVX Interconnect / Elco; Part Number: 04023J1R6ABSTR

## Sheet SCH_WINGLET_ADSB.SchDoc: Winglet ADSB Receiver
size B; DrawnBy: HCAdam; Organization: Aerospace Village; DocumentNumber: WINGLET; Revision: A; SheetNumber: 8; SheetTotal: 10
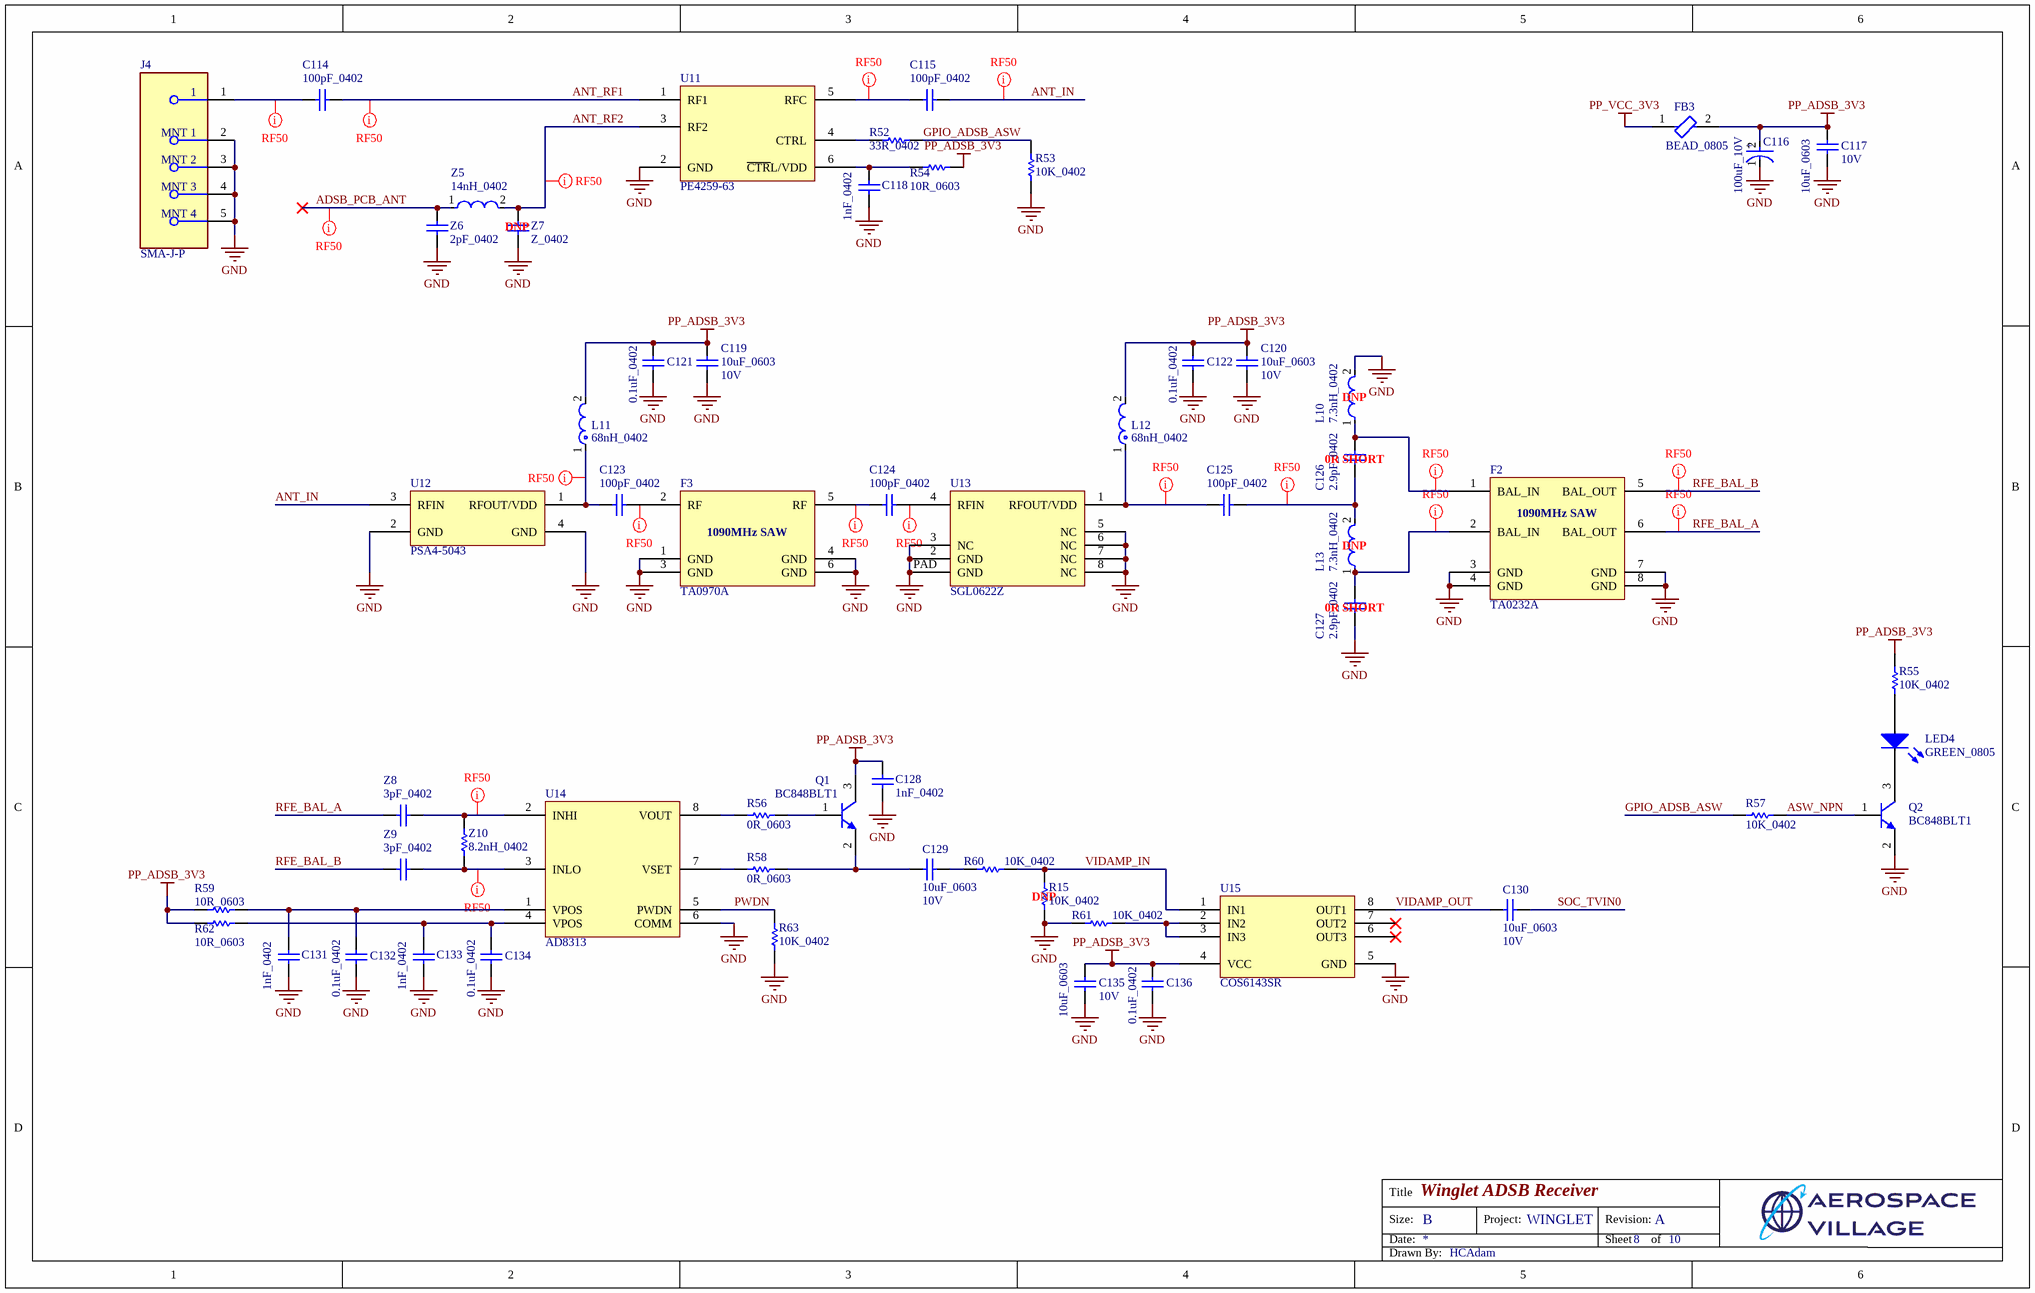
[diagram p7: SCH_WINGLET_ADSB.SchDoc]

### Parts
C114  100pF_0402  [CAPC1005X55X25NL05T10]
C115  100pF_0402  [CAPC1005X55X25NL05T10]
C116  100uF_10V  [FP-TAJB-MFG]
C117  10uF_0603  Voltage Rating: 10V  [CAPC1609X100X15NL20]
C118  1nF_0402  [CAPC1005X56X25NL10T15]
C119  10uF_0603  Voltage Rating: 10V  [CAPC1609X100X15NL20]
C120  10uF_0603  Voltage Rating: 10V  [CAPC1609X100X15NL20]
C121  0.1uF_0402  [CAPC1005X56X25NL10T15]
C122  0.1uF_0402  [CAPC1005X56X25NL10T15]
C123  100pF_0402  [CAPC1005X55X25NL05T10]
C124  100pF_0402  [CAPC1005X55X25NL05T10]
C125  100pF_0402  [CAPC1005X55X25NL05T10]
C126  2.9pF_0402  [CAPC1006X50X20NL10T10]
C127  2.9pF_0402  [CAPC1006X50X20NL10T10]
C128  1nF_0402  [CAPC1005X56X25NL10T15]
C129  10uF_0603  Voltage Rating: 10V  [CAPC1609X100X15NL20]
C130  10uF_0603  Voltage Rating: 10V  [CAPC1609X100X15NL20]
C131  1nF_0402  [CAPC1005X56X25NL10T15]
C132  0.1uF_0402  [CAPC1005X56X25NL10T15]
C133  1nF_0402  [CAPC1005X56X25NL10T15]
C134  0.1uF_0402  [CAPC1005X56X25NL10T15]
C135  10uF_0603  Voltage Rating: 10V  [CAPC1609X100X15NL20]
C136  0.1uF_0402  [CAPC1005X56X25NL10T15]
F2  TA0232A  [LCCS127P380X380X125-8N]
F3  TA0970A  [LCCS127P380X380X125-6N]
FB3  BEAD_0805  [FP-BLM21-0_2-t0_85-e0_5-IPC_B]
J4  SMA-J-P  [FP-SMA-J-P-H-ST-EM1-MFG]
L10  7.3nH_0402  [FP-LQW15AN_00-W0_6-0_1-MFG]
L11  68nH_0402  [FP-LQG15HH_02-MFG]
L12  68nH_0402  [FP-LQG15HH_02-MFG]
L13  7.3nH_0402  [FP-LQW15AN_00-W0_6-0_1-MFG]
LED4  GREEN_0805  [0805_A]
Q1  BC848BLT1  [ONSC-SOT-23-3-318-08_V]
Q2  BC848BLT1  [ONSC-SOT-23-3-318-08_V]
R15  10K_0402  [RESC1005X40X25NL05T05]
R52  33R_0402  [RESC1005X40X25NL05T05]
R53  10K_0402  [RESC1005X40X25NL05T05]
R54  10R_0603  [RESC1608X55X25NL10T15]
R55  10K_0402  [RESC1005X40X25NL05T05]
R56  0R_0603  [RESC1608X55X25LL10T15]
R57  10K_0402  [RESC1005X40X25NL05T05]
R58  0R_0603  [RESC1608X55X25LL10T15]
R59  10R_0603  [RESC1608X55X25NL10T15]
R60  10K_0402  [RESC1005X40X25NL05T05]
R61  10K_0402  [RESC1005X40X25NL05T05]
R62  10R_0603  [RESC1608X55X25NL10T15]
R63  10K_0402  [RESC1005X40X25NL05T05]
U11  PE4259-63  [SOT65P210X100-6N]
U12  PSA4-5043  [SOT343P210X110-4N-MMM]
U13  SGL0622Z  [SON50P200X90_HS-9N]
U14  AD8313  [TSOP65P490X110-8N-AD8313]
U15  COS6143SR  [SOP127P600X175-8N]
Z5  14nH_0402  [FP-LQW15AN_80-MFG]
Z6  2pF_0402  [CAPC1005X55X25NL05T10]
Z7  Z_0402  [CAPC1005X55X25NL05T10]
Z8  3pF_0402  [CAPC1006X50X20NL10T10]
Z9  3pF_0402  [CAPC1006X50X20NL10T10]
Z10  8.2nH_0402  [RESC1005X40X25NL05T05]

### Nets
GND: C116.1(C) C117.1 C118.1 C119.1 C120.1 C121.1 C122.1 C127.1 C128.1 C131.1 C132.1 C133.1 C134.1 C135.1 C136.1 F2.3(GND) F2.4(GND) F2.7(GND) F2.8(GND) F3.1(GND) F3.3(GND) F3.4(GND) F3.6(GND) J4.2(MNT_1) J4.3(MNT_2) J4.4(MNT_3) J4.5(MNT_4) L10.2 Q2.2(E) R15.1 R53.1 R61.1 R63.1 U11.2(GND) U12.2(GND) U12.4(GND) U13.2(GND) U13.3(NC) U13.5(NC) U13.6(NC) U13.7(NC) U13.8(NC) U13.PAD(GND) U14.6(COMM) U15.5(GND) Z6.1 Z7.1
PP_ADSB_3V3: C116.2(A) C117.2 C119.2 C120.2 C121.2 C122.2 C128.2 C135.2 C136.2 FB3.2 L11.2 L12.2 Q1.3(C) R54.2 R55.2 R59.1 R62.1 U15.4(VCC)
PP_VCC_3V3: FB3.1
ADSB_PCB_ANT: Z5.1 Z6.2
ANT_IN: C115.2 U12.3(RFIN)
ANT_RF1: C114.2 U11.1(RF1)
ANT_RF2: U11.3(RF2) Z5.2 Z7.2
ASW_NPN: Q2.1(B) R57.1
GPIO_ADSB_ASW: R52.2 R53.2 R57.2
PWDN: R63.2 U14.5(PWDN)
RFE_BAL_A: F2.6(BAL_OUT) Z8.2
RFE_BAL_B: F2.5(BAL_OUT) Z9.2
SOC_TVIN0: C130.1
VIDAMP_IN: R15.2 R60.2 U15.1(IN1)
VIDAMP_OUT: C130.2 U15.8(OUT1)
NetC114_1: C114.1 J4.1
NetC115_1: C115.1 U11.5(RFC)
NetC118_2: C118.2 R54.1 U11.6(~{CTR}L/VDD)
NetC123_1: C123.1 L11.1 U12.1(RFOUT/VDD)
NetC123_2: C123.2 F3.2(RF)
NetC124_1: C124.1 F3.5(RF)
NetC124_2: C124.2 U13.4(RFIN)
NetC125_1: C125.1 L12.1 U13.1(RFOUT/VDD)
NetC125_2: C125.2 C126.1 L13.2
NetC126_2: C126.2 F2.1(BAL_IN) L10.1
NetC127_2: C127.2 F2.2(BAL_IN) L13.1
NetC129_1: C129.1 R60.1
NetC129_2: C129.2 Q1.2(E) R58.1
NetC131_2: C131.2 C132.2 R59.2 U14.1(VPOS)
NetC133_2: C133.2 C134.2 R62.2 U14.4(VPOS)
NetLED4_1: LED4.1(K) Q2.3(C)
NetLED4_2: LED4.2(A) R55.1
NetQ1_1: Q1.1(B) R56.1
NetR52_1: R52.1 U11.4(CTRL)
NetR56_2: R56.2 U14.8(VOUT)
NetR58_2: R58.2 U14.7(VSET)
NetR61_2: R61.2 U15.2(IN2) U15.3(IN3)
NetU14_2: U14.2(INHI) Z8.1 Z10.2
NetU14_3: U14.3(INLO) Z9.1 Z10.1

Not connected (* = marked no-connect by the designer): U15 6(OUT3)* 7(OUT2)*

### Layout directives
net class RF_50Z: ADSB_PCB_ANT, ANT_IN, ANT_RF1, ANT_RF2, NetC114_1, NetC115_1, NetC123_1, NetC123_2, NetC124_1, NetC124_2, NetC125_1, NetC125_2, NetC126_2, NetC127_2, NetU14_2, NetU14_3, RFE_BAL_A, RFE_BAL_B

### Notes on the sheet
- Title
- Size:
- Date:
- B
- Project:
- Revision:
- Sheet
- of
- Drawn By:
- (in symbol CMP-04424-000366-1) +
- (in symbol TA0232A) 1090MHz SAW
- (in symbol TA0970A) 1090MHz SAW

### Library data of the parts
C114 C115 C123-C125 = CMP-2008-03915-1: GRM1555C1H101JA01D; Manufacturer: Murata; Part Number: GRM1555C1H101JA01D
C116 = CMP-04424-000366-1: as C87 on sheet SCH_WINGLET_WIFI; Height: 1.9mm; Depth: 2.8mm; Length: 3.5mm; Min Operating Temperature: -55°C; Width: 2.8mm; Series: TAJ; Lead Free: Lead Free; Case/Package: 1210; Voltage: 6.3V; Mount: Surface Mount; Tolerance: 10%; Capacitance: 100uF; Radiation Hardening: No; REACH SVHC: No SVHC; Voltage Rating: 6.3V; Case Code (Metric): 3528; Dissipation Factor: 10%; Packaging: Tape and Reel; Construction: Flat; Features: General Purpose; Max Operating Temperature: 125°C; RoHS Compliant: Yes; Package Quantity: 1; Dielectric Material: Tantalum; Termination: SMD/SMT; Case Code (Imperial): 1210; Height - Seated (Max): 0.083inch
C117 C119 C120 C129 C130 C135 = CMP-2006-00191-1: as C71 on sheet SCH_WINGLET_DISP
C118 C128 C131 C133 = CMP-2008-02700-1: 04025C102KAT4A; Manufacturer: AVX Interconnect / Elco; Part Number: 04025C102KAT4A
C121 C122 C132 C134 C136 = CMP-2008-02743-1: as C107 on sheet SCH_WINGLET_GNSS; Part Number: 04026D104KAT2A
C126 C127 = CMP-2008-04791-1: 04023J2R9BBSTR; Manufacturer: AVX Interconnect / Elco; Part Number: 04023J2R9BBSTR; 0R SHORT: 0R SHORT
F2 = TA0232A: SAW Filter 1090MHz Balanced SMD 3.8x3.8mm
F3 = TA0970A: SAW Filter 1090MHz Unbalanced SMD 3.8x3.8mm
FB3 = CMP-0686-00717-3: as FB1 on sheet SCH_WINGLET_WIFI; Contact Plating: Tin; Weight: 0.000194oz; Series: EMIFIL®, BLM21A; Core Material: Ferrite; Test Frequency: 100MHz; Case Code (Metric): 2012; Package Quantity: 4000; Lead Free: Lead Free; Max Operating Temperature: 125°C; Case Code (Imperial): 0805; Material: Ferrite; Min Operating Temperature: -55°C; Tolerance: 25%; Length: 2mm; DC Resistance-Max: 100mR; Width: 1.25mm; RoHS Compliant: Yes; Packaging: Tape and Reel; REACH SVHC: No SVHC; Depth: 1.45mm; Number of Pins: 2; Radiation Hardening: No; Current Rating: 800mA; Height: 0.85mm; Termination: SMD/SMT; Number of Lines: 1; Max DC Current: 200mA; Case/Package: 0805
J4 = CMP-02754-000006-1: CONN SMA JACK STR 50OHM EDGE MNT / SMA-J-P-H-ST-EM1; Dielectric Material: PTFE; Center Contact Plating: Gold; Max Frequency: 6GHz; Body Material: Brass; Voltage Rating: 335V; Impedance: 50R; Package Quantity: 1; Case/Package: SMA; Max Operating Temperature: 125°C; Fastening Type: Threaded; Orientation: Straight; Depth: 13.33mm; RoHS Compliant: Yes; Length: 6.35mm; Insulation Material: Polytetrafluoroethylene; Termination: Solder; Min Operating Temperature: -65°C; Housing Color: Gold; Contact Plating: Gold; Contact Material: Copper; Connector Type: SMA; Mount: Edge; Series: SMA; Packaging: Tray; Body Plating: Gold; Radiation Hardening: No
L10 L13 = CMP-06042-005854-1: Wire Wound RF Inductor 7.3nH ±3% 570mA 0.13Ω 0402 (1005) / LQW15AN7N3H00D; Self Resonant Frequency: 6GHz; DC Resistance (DCR): 130mR; Test Frequency: 100MHz; Shielding: Unshielded; Core Material: Non-Magnetic; Q Factor: 25; Width: 0.02inch; Min Operating Temperature: -55°C; Current Rating: 570mA; Depth: 0.7mm; Weight: 2.8E-05oz; Termination: SMD/SMT; Case Code (Imperial): 0402; Max Operating Temperature: 125°C; Mount: Surface Mount; Case Code (Metric): 1005; Military Standard: Not; Case/Package: 0402; Radiation Hardening: No; Package Quantity: 10000; Height - Seated (Max): 0.024inch; Tolerance: 3%; Max DC Current: 570mA; Inductance: 7.3nH; Packaging: Tape and Reel; DC Current: 570mA; Resistor Type: Wirewound; Height: 0.5mm; Length: 1mm; DNP: DNP
L11 L12 = CMP-06042-006384-1: Multilayer type RF Inductor 68nH ±5% 0.92Ω 250mA 0402 / LQG15HS68NJ02D; Current Rating: 180mA; Shielding: Unshielded; Core Material: Air; Self Resonant Frequency: 800MHz; DC Resistance (DCR): 920mR; Test Frequency: 100MHz; Q Factor: 8; Length: 1mm; Max Operating Temperature: 125°C; Width: 0.02inch; Case Code (Metric): 1005; Package Quantity: 1; Termination: SMD/SMT; Tolerance: 5%; Packaging: Tape and Reel; Radiation Hardening: No; Inductance: 68nH; Case Code (Imperial): 0402; Lead Free: Lead Free; Mount: Surface Mount; Max DC Current: 180mA; Case/Package: 0402; Height: 0.5mm; DC Current: 180mA; Military Standard: Not; Min Operating Temperature: -55°C; Height - Seated (Max): 0.022inch; Depth: 0.55mm
LED4 = CMP-1426-00007-1: as LED3 on sheet SCH_WINGLET_WIFI; PackageReference: 0805_A; Color: Green; PartNumber: 150080GS75000; ComponentLink2URL: http://katalog.we-online.com/led/datasheet/150080GS75000.pdf; ComponentLink1URL: http://www.we-online.com; ComponentLink1Description: Manufacturer URL; ComponentLink2Description: Datasheet
Q1 Q2 = CMP-1048-00685-1: General Purpose Transistor, NPN Silicon, 3-Pin SOT-23, Tape and Reel; Manufacturer: On Semiconductor; fT Min (MHz): 100; IC Continuous (A): 0.1; ComponentLink1URL: http://www.onsemi.com/; PackageDescription: 3-Pin Small Outline Transistor, Body 2.92 x 1.3 mm, Pitch 0.95 mm; PackageReference: SOT-23-3-318-08; PackageVersion: Rev. AP, 11/2009; Polarity: NPN; ComponentLink2URL: http://www.onsemi.cn/pub_link/Collateral/BC846ALT1-D.PDF; ComponentLink3Description: Package Specification; Packing: Tape and Reel; DatasheetVersion: Rev. 11; ComponentLink2Description: Datasheet; ComponentLink1Description: Manufacturer URL; PartNumber: BC848BLT1; RoHS: FALSE; ComponentLink3URL: http://www.onsemi.cn/pub_link/Collateral/318-08.PDF; Mounting Technology: Surface Mount
R15 R53 R55 R57 R60 R61 R63 Z10 = CMP-2000-07588-1: as R37 on sheet SCH_WINGLET_DISP; RoHSCompliant: True; Lead Free: LeadFree; Package Quantity: 1; Contact Plating: Tin; Length: 1mm; Radiation Hardening: No; REACH SVHC: NoSVHC; Max Operating Temperature: 155degC; Depth: 0.5mm; Case Code (Imperial): 0402; Military Standard: Not; Package Description: 2-Pin Surface Mount Device, Body 1 x 0.5 mm; Termination: SMD/SMT; Case Code (Metric): 1005; Height: 0.35mm; Packaging: TapeandReel; Voltage Rating (DC): 50V; Package Reference: 402; Number of Pins: 2; Tolerance: 1%; Mounting Technology: SurfaceMount; Width: 0.02inch; Mount: SurfaceMount; Datasheet URL: https://industrial.panasonic.com/cdbs/www-data/pdf/RDA0000/AOA0000C304.pdf; Composition: ThickFilm; Datasheet Version: 02/2017; Manufacturer URL: http://www.panasonic.com/; Max Power Dissipation: 100mW; Number of Terminations: 2; Min Operating Temperature: -55degC
  R15: DNP: DNP
R52 = CMP-2002-01146-1: ERJ2RKF33R0X; Manufacturer: Panasonic; Part Number: ERJ2RKF33R0X
R54 R59 R62 = CMP-1659-00008-4: Chip Resistor, 10 Ohm, +/- 1%, 0.1 W, -55 to 155 degC, 0603 (1608 Metric), RoHS, Tape and Reel / RC0603FR-0710RL; Manufacturer: Yageo; Voltage Rating: 50 V; PackageReference: 0603; ComponentLink3Description: Package Specification; Packaging: Tape and Reel; Max Operating Temperature: 155 degC; ComponentLink3URL: http://www.farnell.com/datasheets/443971.pdf; PackageDescription: 2-Pin Surface Mount Device, Body 1.6 x 0.8 mm; ComponentLink1URL: http://www.yageo.com/; Pins: 2; REACH SVHC: No SVHC; RoHSCompliant: true; ComponentLink2URL: http://www.yageo.com/documents/recent/PYu-RC_Group_51_RoHS_L_04.pdf; DatasheetVersion: Rev. 4, 02/2016; Mount: Surface Mount; Package Quantity: 200; Min Operating Temperature: -55 degC; Height: 0.45 mm; Mounting Technology: Surface Mount; ComponentLink1Description: Manufacturer URL; ComponentLink2Description: Datasheet; Length: 1.6 mm
R56 R58 = CMP-2000-04300-1: RC0603JR-100RL; Manufacturer: Yageo; Part Number: RC0603JR-100RL
U11 = PE4259: SPDT High Power UltraCMOS® / 10 MHz–3.0 GHz RF Switch
U12 = PSA4-5043: 50Ω 0.05 to 4 GHz Ultra-Low Noise MMIC Amplifier
U13 = SGL0622Z: 5 MHz to 4000 MHz, Low-Noise SiGe HBT MMIC Amplifier
U14 = AD8313: 0.1 GHz to 2.5 GHz 70 dB Logarithmic Detector/Controller
U15 = COS6143SR: Triple, 6th Order, Standard Definition Video Filter Driver
Z5 = CMP-06042-012069-1: Wire Wound RF Inductor 14nH ±2% 1150mA 0.111Ω 0402 (1005) / LQW15AN14NG80D; Max DC Current: 1.15A; Shielding: Unshielded; Self Resonant Frequency: 5.2GHz; Core Material: Non-Magnetic; Test Frequency: 100MHz; Q Factor: 31; DC Resistance (DCR): 111mR; Min Operating Temperature: -55°C; Current Rating: 1.15A; Inductance: 14nH; Width: 0.5mm; Package Quantity: 1; Lead Free: Lead Free; Resistor Type: Wirewound; Mount: Surface Mount; Case Code (Metric): 1005; Case Code (Imperial): 0402; Length: 0.039inch; Tolerance: 2%; Max Operating Temperature: 125°C; Termination: SMD/SMT; Height - Seated (Max): 0.024inch; Packaging: Tape and Reel; Case/Package: 0402; Height: 0.5mm
Z6 Z7 = CMP-2008-04315-1: GRM1555C1H2R0CA01D; Manufacturer: Murata; Part Number: GRM1555C1H2R0CA01D
  Z7: DNP: DNP
Z8 Z9 = CMP-2008-04829-1: Manufacturer: AVX Interconnect / Elco; Part Number: 0402YJ100FBSTR